# Altium project Motoransteuerung.PrjPCB
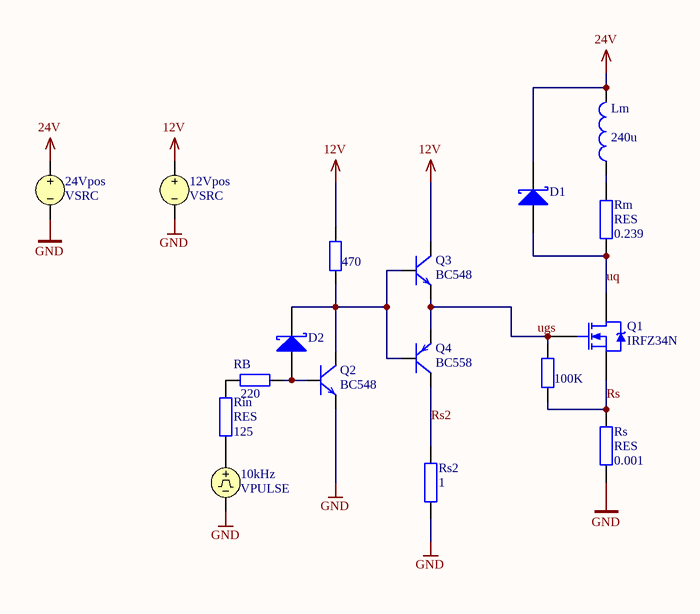
[diagram p0: Motoransteurung.SchDoc]
1 sheet, 17 parts. Net scope: global (net labels, ports and power ports of the same name join across sheets).
Board files: Motoransteuerung_v2.PcbDoc, Motoransteurung_v1.PcbDoc

## Sheet Motoransteurung.SchDoc
size A4

### Parts
10kHz  VPULSE
12Vpos  VSRC
24Vpos  VSRC
D1  DSchottky  [DIODE-0.4/085]  (value not drawn)
D2  D Schottky  [DIODE-0.4/085]  (value not drawn)
Lm  value 240u  [0402-A]  (hidden comment: Inductor)
Q1  IRFZ34N  [TO-220AB]
Q2  BC548  [TO-92/EBC]
Q3  BC548  [TO-92/EBC]
Q4  BC558  [TO-92/EBC]
R3  value 470  [AXIAL-0.4]  (hidden comment: Res2)
R7  value 100K  [AXIAL-0.4]  (hidden comment: Res2)
RB  value 220  [AXIAL-0.4]  (hidden comment: Res2)
Rin  RES  value 125  [Axial-0.4]
Rm  RES  value 0.239  [Axial-0.4]
Rs  RES  value 0.001  [Axial-0.4]
Rs2  value 1  [Axial-0.4]  (hidden comment: RES)

### Nets
12V: 12Vpos.1 Q3.3(C) R3.1
24V: 24Vpos.1 D1.2(K) Lm.2
GND: 10kHz.2 12Vpos.2 Q2.2(E) Rs.2 Rs2.2
Rs: Q1.3(S) R7.2 Rs.1
Rs2: Q4.3(C) Rs2.1
ugs: Q1.1(G) Q3.2(E) Q4.2(E) R7.1
uq: D1.1(A) Q1.2(D) Rm.1
Net10kHz_1: 10kHz.1 Rin.1
NetD2_1: D2.1(A) Q2.1(B) RB.1
NetD2_2: D2.2(K) Q2.3(C) Q3.1(B) Q4.1(B) R3.2
NetLm_1: Lm.1 Rm.2
NetRB_2: RB.2 Rin.2

Not connected (* = marked no-connect by the designer): 24Vpos 2

### Notes on the sheet
- Labels drawn without touching a wire or pin: GND

### Library data of the parts
10kHz = VPULSE: Pulse Voltage Source; Note: PCB Footprint - Not required; Published: 8-Jun-2000; LatestRevisionDate: 15-Nov-2004; LatestRevisionNote: Corrected Netlist.; PackageReference: Not Applicable; Publisher: Altium Limited
12Vpos = VSRC: Voltage Source; Note: PCB Footprint - Not required; Value: +12; Published: 8-Jun-2000; LatestRevisionDate: 17-Jul-2002; LatestRevisionNote: Re-released for DXP Platform.; PackageReference: Not Applicable; Publisher: Altium Limited
24Vpos = VSRC: Voltage Source; Note: PCB Footprint - Not required; Value: +24; Published: 8-Jun-2000; LatestRevisionDate: 17-Jul-2002; LatestRevisionNote: Re-released for DXP Platform.; PackageReference: Not Applicable; Publisher: Altium Limited
D1 D2 = D Schottky: Schottky Diode; Published: 8-Jun-2000; LatestRevisionDate: 17-Jul-2002; LatestRevisionNote: Re-released for DXP Platform.; PackageReference: SMB; Publisher: Altium Limited; PackageDescription: DO-214-AA/SMB; 2 C-Bend Leads; Body 5.3 x 3.6 mm, inc. leads (LxW); Code_JEDEC: DO-214-AA
Lm = Inductor: Code_IEC: 1005; Published: 8-Jun-2000; LatestRevisionDate: 29-May-2009; LatestRevisionNote: IPC-7351 Footprint Added.; PackageReference: 0402-A; Publisher: Altium Limited; PackageDescription: Chip Inductor; Code_JEITA: 0402
Q1 = IRFZ34N: HEXFET Power MOSFET; Note: Pin 2 is electrically connected to pin 4.; Published: 8-Jun-2000; LatestRevisionDate: 17-Jul-2002; LatestRevisionNote: Re-released for DXP Platform.; DatasheetVersion: Aug-1997; PackageVersion: Feb-1997; PackageReference: TO-220AB; Publisher: Altium Limited; PackageDescription: TO, Thru-Hole, Vertical, Heatsink Mounted; 3 In-Line Leads; Pitch 2.54 mm; ComponentLink1Description: Manufacturer Link; ComponentLink1URL: http://www.irf.com/; ComponentLink2Description: Datasheet; ComponentLink2URL: http://www.irf.com/product-info/datasheets/data/irfz34n.pdf
Q2 Q3 = NPN: Transistor
Q4 = PNP: Transistor
R3 R7 RB = Res2: Resistor; Published: 8-Jun-2000; LatestRevisionDate: 17-Jul-2002; LatestRevisionNote: Re-released for DXP Platform.; PackageReference: AXIAL-0.4; Publisher: Altium Limited; PackageDescription: Axial Device, Thru-Hole; 2 Leads; 0.4 in Pin Spacing
Rin Rm Rs Rs2 = RES: Widerstand